# Altium project DM6010_R2M2E2.PrjPcb
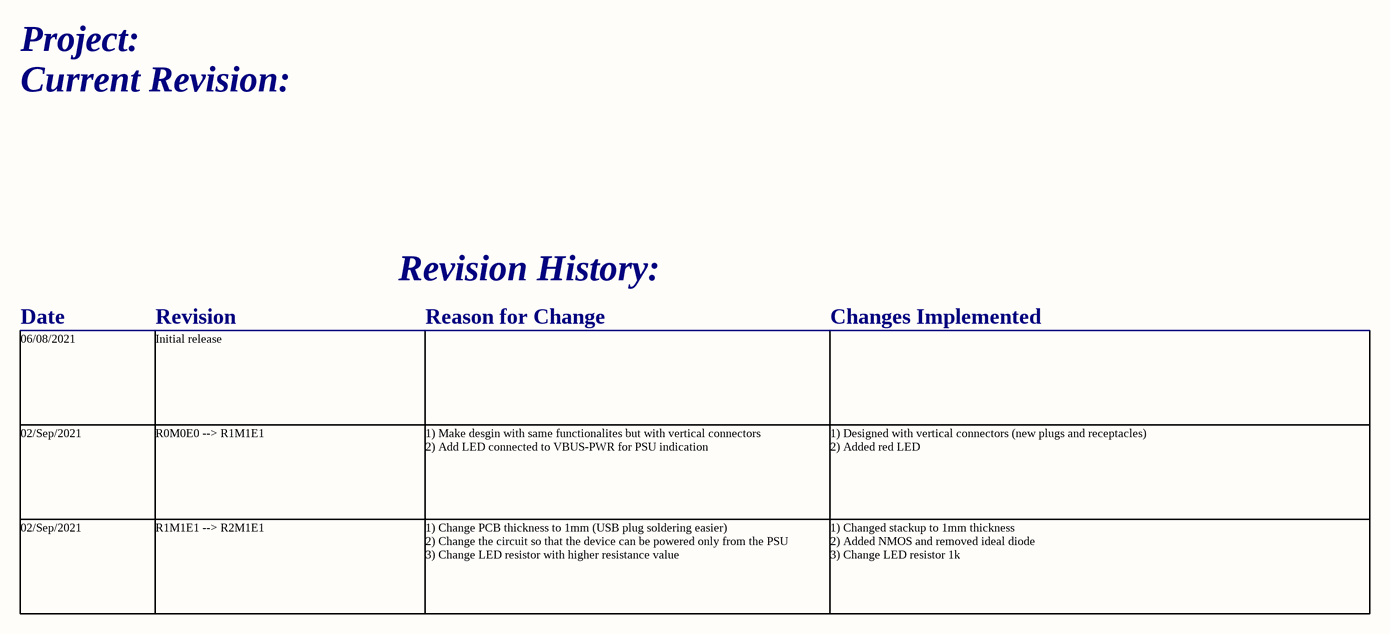
[diagram p0: Project_Information.SchDoc]
document_number: D0001093; drawn_by: David Malovrh; project_title: DM6010; revision: R2M2E2
2 sheets, 12 parts. Net scope: strictly hierarchical (ports join the sheet entries above them; power ports are local).
Board file: DM6010_R2M2E2.PcbDoc
Sheets:
  Project_Information.SchDoc
  DM6010.SchDoc

## Sheet Project_Information.SchDoc: =project_title
size Tabloid; CompanyName: Luxonis Holding; DrawnBy: David Malovrh; Organization: Luxonis Holding; Address1: 1925 Harmony Park Drive; Address2: Westminster, CO; Address3: 80234; Address4: United States; DocumentNumber: D0001093; Revision: R2M2E2; SheetNumber: 1; SheetTotal: 9

### Notes on the sheet
- Project:
- Current Revision:
- Revision History:
- Date
- Revision
- Reason for Change
- Changes Implemented
- 06/08/2021
- Initial release
- 02/Sep/2021
- R0M0E0 --> R1M1E1
- 1) Make desgin with same functionalites but with vertical connectors
  2) Add LED connected to VBUS-PWR for PSU indication
- 1) Designed with vertical connectors (new plugs and receptacles)
  2) Added red LED
- R1M1E1 --> R2M1E1
- 1) Change PCB thickness to 1mm (USB plug soldering easier)
  2) Change the circuit so that the device can be powered only from the PSU
  3) Change LED resistor with higher resistance value
- 1) Changed stackup to 1mm thickness
  2) Added NMOS and removed ideal diode
  3) Change LED resistor 1k
- Title
- Size:
- Date:
- Tabloid
- Number:
- Time:
- Revision:
- Sheet
- of
- Drawn by:

## Sheet DM6010.SchDoc: =project_title
size Tabloid; CompanyName: Luxonis Holding; DrawnBy: David Malovrh; Organization: Luxonis Holding; Address1: 1925 Harmony Park Drive; Address2: Westminster, CO; Address3: 80234; Address4: United States; DocumentNumber: D0001093; Revision: R2M2E2; SheetNumber: 9; SheetTotal: 9
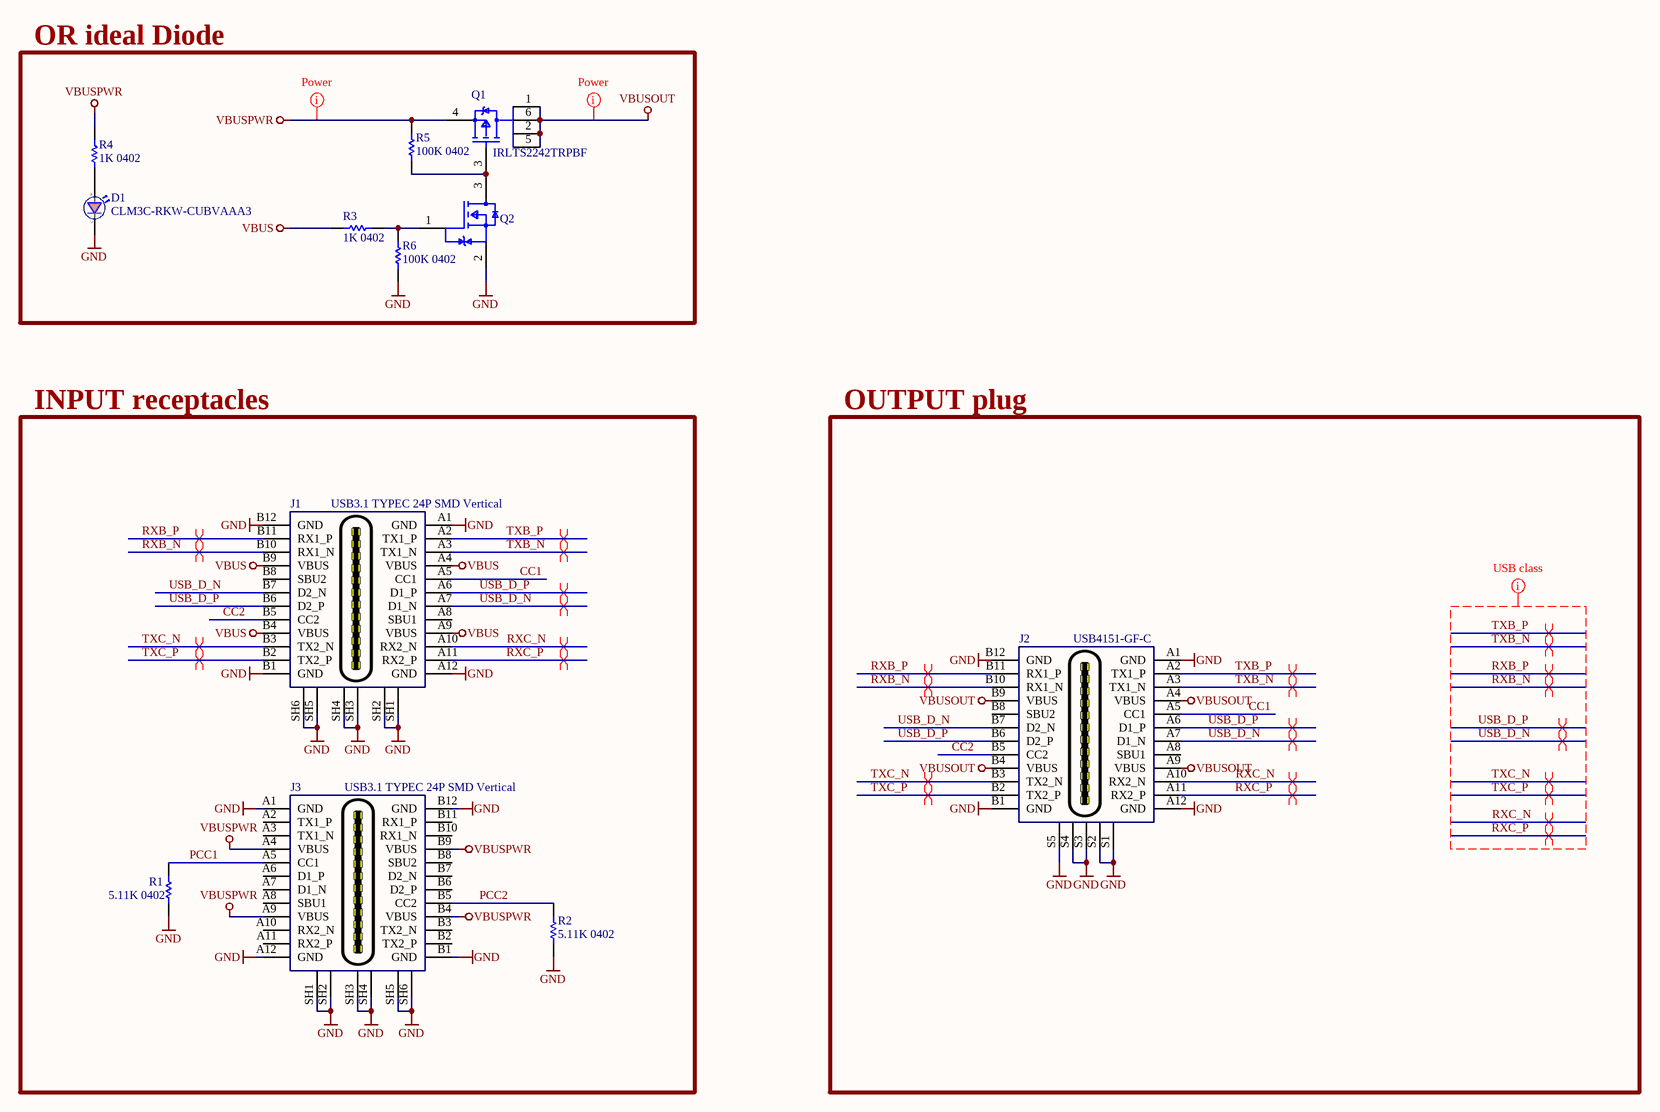
[diagram p1: DM6010.SchDoc]

### Parts
D1  CLM3C-RKW-CUBVAAA3  [CLM3C-RKW-CUBVAAA3]
J1  USB3.1 TYPEC 24P SMD Vertical  [CX80B1-24P]
J2  USB4151-GF-C  [GCT_USB4151-GF-C_REVA]
J3  USB3.1 TYPEC 24P SMD Vertical  [CX80B1-24P]
Q1  IRLTS2242TRPBF  [TSOP-6-MFG]
Q2  RE1C002UNTCL  [RE1C002UNTCL]  (value not drawn)
R1  5.11K 0402  [RESC0402(1005)_L]
R2  5.11K 0402  [RESC0402(1005)_L]
R3  1K 0402  [RESC0402(1005)_L]
R4  1K 0402  [RESC0402(1005)_L]
R5  100K 0402  [RESC0402(1005)_L]
R6  100K 0402  [RESC0402(1005)_L]

### Blocks framed on the sheet
OR ideal Diode: D1 Q1 Q2 R3-R6
INPUT receptacles: J1 J3 R1 R2
OUTPUT plug: J2

### Nets
GND: D1.2(C) J1.A1(GND) J1.A12(GND) J1.B1(GND) J1.B12(GND) J1.SH1(SH) J1.SH2(SH) J1.SH3(SH) J1.SH4(SH) J1.SH5(SH) J1.SH6(SH) J2.A1(GND) J2.A12(GND) J2.B1(GND) J2.B12(GND) J2.S1(SH) J2.S2(SH) J2.S3(SH) J2.S4(SH) J2.S5(SH) J3.A1(GND) J3.A12(GND) J3.B1(GND) J3.B12(GND) J3.SH1(SH) J3.SH2(SH) J3.SH3(SH) J3.SH4(SH) J3.SH5(SH) J3.SH6(SH) Q2.2(Source) R1.1 R2.1 R6.1
VBUS: J1.A4(VBUS) J1.A9(VBUS) J1.B4(VBUS) J1.B9(VBUS) R3.1
VBUSOUT: J2.A4(VBUS) J2.A9(VBUS) J2.B4(VBUS) J2.B9(VBUS) Q1.1(D) Q1.2(D) Q1.5(D) Q1.6(D)
VBUSPWR: J3.A4(VBUS) J3.A9(VBUS) J3.B4(VBUS) J3.B9(VBUS) Q1.4(S) R4.2 R5.2
CC1: J1.A5(CC1) J2.A5(CC1)
CC2: J1.B5(CC2) J2.B5(CC2)
PCC1: J3.A5(CC1) R1.2
PCC2: J3.B5(CC2) R2.2
RXB_N: J1.B10(RX1_N) J2.B10(RX1_N)
RXB_P: J1.B11(RX1_P) J2.B11(RX1_P)
RXC_N: J1.A10(RX2_N) J2.A10(RX2_N)
RXC_P: J1.A11(RX2_P) J2.A11(RX2_P)
TXB_N: J1.A3(TX1_N) J2.A3(TX1_N)
TXB_P: J1.A2(TX1_P) J2.A2(TX1_P)
TXC_N: J1.B3(TX2_N) J2.B3(TX2_N)
TXC_P: J1.B2(TX2_P) J2.B2(TX2_P)
USB_D_N: J1.A7(D1_N) J1.B7(D2_N) J2.A7(D1_N) J2.B7(D2_N)
USB_D_P: J1.A6(D1_P) J1.B6(D2_P) J2.A6(D1_P) J2.B6(D2_P)
NetD1_1: D1.1(A) R4.1
NetQ1_3: Q1.3(G) Q2.3(Drain) R5.1
NetQ2_1: Q2.1(Gate) R3.2 R6.2

Not connected (* = marked no-connect by the designer): J1 A8(SBU1) B8(SBU2); J2 A8(SBU1) B8(SBU2); J3 A2(TX1_P) A3(TX1_N) A6(D1_P) A7(D1_N) A8(SBU1) A10(RX2_N) A11(RX2_P) B2(TX2_P) B3(TX2_N) B6(D2_P) B7(D2_N) B8(SBU2) B10(RX1_N) B11(RX1_P)

### Layout directives
differential pair; differential pair class USB3: RXB_N, RXB_P, RXC_N, RXC_P, TXB_N, TXB_P, TXC_N, TXC_P, USB_D_N, USB_D_P
rule Matched Net Lengths [Delay Tolerance = 0,5ps]; net class USB: RXB_N, RXB_P, RXC_N, RXC_P, TXB_N, TXB_P, TXC_N, TXC_P, USB_D_N, USB_D_P
net class Power_trace: VBUSOUT, VBUSPWR

### Notes on the sheet
- Title
- Size:
- Date:
- Tabloid
- Number:
- Time:
- Revision:
- Sheet
- of
- Drawn by:

### Library data of the parts
D1 = CLM3C-RKW-CUBVAAA3: Single Color LED, Red; Manufacturer 1: Cree; Shape: Rectangular; Additional Feature: HIGH RELIABILITY; Forward Current-Max: 50mA; Luminous Intensity-Nom: 730mcd; Number of Functions: 1; Viewing Angle: 120°; Overall Height: 1.3mm; Supplier 1: Arrow Electronics; Manufacturer Part Number 1: CLM3C-RKW-CUBVAAA3; RoHS: Yes; Category: LEDs; Stock 1: 46; Pricing 1: 1=0,16910, 10=0,15700, 25=0,15600, 3000=0,11060, 6000=0,10380, 9000=0,10200 (USD); Mount: Surface Mount; Number of Pins: 2; Color: Red; Min Operating Temperature: -40°C; Max Operating Temperature: 100°C; Optoelectronic Device Type: SINGLE COLOR LED; Packaging: Tape and Reel; REACH SVHC: No SVHC; RoHS Compliant: Yes; ComponentLink1URL: https://datasheet.ciiva.com:443/pdfs/VipMasterIC/IC/CREE/CREE-S-A0009778054/CREE-S-A0009831191-1.pdf?src-supplier=IHS+Markit; ComponentLink1Description: https://datasheet.ciiva.com:443/pdfs/VipMasterIC/IC/CREE/CREE-S-A0009778054/CREE-S-A0009831191-1.pdf?src-supplier=IHS+Markit; ComponentLink2URL: https://datasheet.ciiva.com/15210/getdatasheetpartid-563038-15210357.pdf?src-supplier=Verical; ComponentLink2Description: https://datasheet.ciiva.com/15210/getdatasheetpartid-563038-15210357.pdf?src-supplier=Verical; ComponentLink3URL: https://datasheet.ciiva.com/2116/clm3crkwakw1156-2116358.pdf?src-supplier=Digi-Key; ComponentLink3Description: https://datasheet.ciiva.com/2116/clm3crkwakw1156-2116358.pdf?src-supplier=Digi-Key; Supplier Part Number 1: CLM3C-RKW-CUBVAAA3
J1 J3 = CX80B1-24P: CONN RCPT USB3.1 TYPEC 24POS SMD Vertical; Manufacturer 1: Hirose Electric Co Ltd; Connector Type: USB; Number of Contacts: 24; Gender: Receptacle; Number of Ports: 1; Current Rating: 1.25A; Mating Cycles: 10000; Pitch: 0.5mm; Shielding: Shielded; Supplier 1: Digi-Key; Case/Package: 0101; Number of Pins: 24; Contact Material: Copper Alloy; Contact Plating: Gold; Number of Terminals: 24; Housing Material: Thermoplastic; Insulation Color: Black; Min Operating Temperature: -30°C; Max Operating Temperature: 80°C; Packaging: Tape and Reel; Orientation: Vertical; Termination: Solder; USB Standard: USB 3.1; Features: Shielded; Length: 8.94mm; REACH SVHC: Unknown; Flammability Rating: UL94 V-0; Supplier Part Number 1: 26-CX80B1-24PCT-ND; Mount: Surface Mount,Through Hole,Vertical; RoHS: Yes; Pricing 1: 1=2.15000, 10=1.94900, 25=1.82960, 50=1.75000, 100=1.67050, 250=1.51140, 500=1.39208 (USD); Stock 1: 939; Manufacturer Part Number 1: CX80B1-24P; ComponentLink1Description: Product page; ComponentLink1URL: https://www.jae.com/en/connectors/series/detail/product/id=66513; ComponentLink2Description: Digikey; ComponentLink2URL: https://www.digikey.com/en/products/detail/jae-electronics/DX07S024WJ3R400/6594044
J2 = USB4151-GF-C: USB Connector, 24 Contact(s), Male, Straight, Surface Mount Terminal, Locking, Plug; Manufacturer 1: Global Connector Technology; Supplier 1: Newark; Manufacturer Part Number 1: USB4151-GF-C; RoHS: Yes; Stock 1: 1006; Pricing 1: 1=1,89000, 10=1,74000, 25=1,62000, 50=1,50000, 100=1,35000, 250=1,20000 (USD); Supplier Part Number 1: 86AH2023
Q1 = IRLTS2242TRPBF: MOSFET P-CH 20V 6.9A 6TSOP; Manufacturer 1: Infineon; Rise Time: 18ns; Threshold Voltage: -400mV; Max Power Dissipation: 2W; Gate to Source Voltage (Vgs): 12V; Input Capacitance: 905pF; Max Dual Supply Voltage: -20V; Rds On Max: 32mR; Contact Plating: Tin; Number of Pins: 6; Mount: Surface Mount; Halogen Free: Halogen Free; Packaging: Tape and Reel; Continuous Drain Current (ID): 6.9A; Case/Package: TSOP; REACH SVHC: No SVHC; RoHS Compliant: Yes; Min Operating Temperature: -55°C; Lead Free: Lead Free; Max Operating Temperature: 150°C; Drain to Source Voltage (Vdss): -20V; Manufacturer Part Number 1: IRLTS2242TRPBF
Q2 = RE1C002UNTCL: VISHAY - SI1062X-T1-GE3 - MOSFET Transistor, N Channel, 530 mA, 20 V, 0.35 ohm, 4.5 V, 1 V; Manufacturer 1: Rohm; Drain to Source Voltage (Vdss): 20V; Continuous Drain Current (ID): 200mA; Rds On Max: 1.2R; Input Capacitance: 25pF; Max Power Dissipation: 150mW; Rise Time: 14ns; Drain to Source Resistance: 350mR; Gate to Source Voltage (Vgs): 8V; Fall Time: 11ns; Turn-Off Delay Time: 16ns; Number of Elements: 1; Power Dissipation: 220mW; Turn-On Delay Time: 2ns; Threshold Voltage: 1V; Element Configuration: Single; On-State Resistance: 420mR; Polarity: N-CHANNEL; RoHS: Yes; Mount: Surface Mount; Case/Package: SOT-89; Packaging: Tape and Reel; Lead Free: Lead Free; ComponentLink1URL: http://www.mouser.com/ds/2/348/re1c002untcl-e-1018231.pdf?src-supplier=Mouser; ComponentLink1Description: http://www.mouser.com/ds/2/348/re1c002untcl-e-1018231.pdf?src-supplier=Mouser; ComponentLink2URL: http://rohmfs.rohm.com/en/techdata_basic/transistor/taping/EMT3_TL_taping.pdf?src-supplier=Digi-Key; ComponentLink2Description: http://rohmfs.rohm.com/en/techdata_basic/transistor/taping/EMT3_TL_taping.pdf?src-supplier=Digi-Key; ComponentLink3URL: http://rohmfs.rohm.com/en/products/databook/datasheet/discrete/transistor/mosfet/re1c002un.pdf?src-supplier=Avnet; ComponentLink3Description: http://rohmfs.rohm.com/en/products/databook/datasheet/discrete/transistor/mosfet/re1c002un.pdf?src-supplier=Avnet; ComponentLink4URL: https://www.rohm.com/datasheet/RE1C002UN/re1c002untcl-e?src-supplier=Digi-Key; ComponentLink4Description: https://www.rohm.com/datasheet/RE1C002UN/re1c002untcl-e?src-supplier=Digi-Key; ComponentLink5URL: http://www.farnell.com/datasheets/2704376.pdf?src-supplier=Newark; ComponentLink5Description: http://www.farnell.com/datasheets/2704376.pdf?src-supplier=Newark; ComponentLink6URL: http://www.farnell.com/datasheets/2704376.pdf?src-supplier=Farnell; ComponentLink6Description: http://www.farnell.com/datasheets/2704376.pdf?src-supplier=Farnell; ComponentLink7URL: http://www.farnell.com/datasheets/2704376.pdf?src-supplier=Element14; ComponentLink7Description: http://www.farnell.com/datasheets/2704376.pdf?src-supplier=Element14; Supplier 1: Digi-Key; Manufacturer Part Number 1: RE1C002UNTCL; Stock 1: 868886; Pricing 1: 1=0.20000, 10=0.18200, 100=0.09930, 500=0.06112, 1000=0.04167 (USD); Supplier Part Number 1: RE1C002UNTCLCT-ND; Supplier 2: Digi-Key; Manufacturer 2: Vishay Siliconix; Manufacturer Part Number 2: SI1062X-T1-GE3; Category: MOSFETs; Stock 2: 28076; Pricing 2: 1=0,47000, 10=0,33100, 25=0,30800, 100=0,16720, 500=0,13640, 1000=0,10120 (USD); Number of Pins: 3; Weight: 0.001058oz; Min Operating Temperature: -55°C; Max Operating Temperature: 150°C; Package Quantity: 3000; Drain to Source Breakdown Voltage: 20V; Number of Channels: 1; Series: TrenchFET®; Drain-source On Resistance-Max: 420mR; REACH SVHC: No SVHC; RoHS Compliant: Yes; ComponentLink8URL: https://datasheet.ciiva.com/6376/si1062x-6376310.pdf?src-supplier=Digi-Key; ComponentLink8Description: https://datasheet.ciiva.com/6376/si1062x-6376310.pdf?src-supplier=Digi-Key; ComponentLink9URL: https://datasheet.ciiva.com/24011/si1062x-256537-24011195.pdf?src-supplier=Mouser; ComponentLink9Description: https://datasheet.ciiva.com/24011/si1062x-256537-24011195.pdf?src-supplier=Mouser; ComponentLink10URL: https://datasheet.ciiva.com/6376/si1062x-6376251.pdf?src-supplier=Digi-Key; ComponentLink10Description: https://datasheet.ciiva.com/6376/si1062x-6376251.pdf?src-supplier=Digi-Key; Supplier 3: Digi-Key; Supplier Part Number 2: SI1062X-T1-GE3CT-ND; Supplier Part Number 3: SI1062X-T1-GE3TR-ND
R1 R2 = RC0402FR-075K11L: RES SMD 5.11K OHM 1% 1/16W 0402 5.11 kOhms ±1% 0.063W, 1/16W Chip Resistor 0402 (1005 Metric) Moisture Resistant Thick Film; Manufacturer 1: Yageo; Resistance: 5.11kR; Power Rating: 62.5mW; Voltage Rating: 50V; Temperature Coefficient: 100ppm/°C; Max Power Dissipation: 63mW; ComponentLink1URL: https://datasheet.ciiva.com/2518/pyu-r-int-thick-7-2518982.pdf?src-supplier=Digi-Key; ComponentLink1Description: https://datasheet.ciiva.com/2518/pyu-r-int-thick-7-2518982.pdf?src-supplier=Digi-Key; ComponentLink2URL: https://datasheet.ciiva.com/2518/pyu-r-int-thick-7-2518983.pdf?src-supplier=Digi-Key; ComponentLink2Description: https://datasheet.ciiva.com/2518/pyu-r-int-thick-7-2518983.pdf?src-supplier=Digi-Key; ComponentLink3URL: https://datasheet.ciiva.com/5684/1018594-5684622.pdf?src-supplier=Farnell; ComponentLink3Description: https://datasheet.ciiva.com/5684/1018594-5684622.pdf?src-supplier=Farnell; ComponentLink4URL: https://datasheet.ciiva.com/16743/pyu-rc0402-51-rohs-l-6-r-16743871.pdf?src-supplier=Future+Electronics; ComponentLink4Description: https://datasheet.ciiva.com/16743/pyu-rc0402-51-rohs-l-6-r-16743871.pdf?src-supplier=Future+Electronics; Supplier 1: Digi-Key; Manufacturer Part Number 1: RC0402FR-075K11L; Stock 1: 1263456; Pricing 1: 1=0.10000, 10=0.01600, 100=0.00670, 1000=0.00301, 2500=0.00261, 5000=0.00215 (USD); RoHS: Yes; Case/Package: 0402; Case Code (Imperial): 0402; Case Code (Metric): 1005; Min Operating Temperature: -55°C; Max Operating Temperature: 155°C; Tolerance: 1%; Packaging: Tape and Reel; Package Quantity: 1; Termination: SMD/SMT; Composition: Thick Film; Number of Terminations: 2; Military Standard: Not; Voltage Rating (DC): 50V; Working Voltage: 50V; Features: Moisture Resistant; Length: 1mm; Height: 0.016inch; Width: 0.02inch; Depth: 0.5mm; Lead Free: Lead Free; Supplier Part Number 1: 311-5.11KLRCT-ND
R3 R4 = RC0402FR-071KL: RES SMD 1K OHM 1% 1/16W 0402 1 kOhms ±1% 0.063W, 1/16W Chip Resistor 0402 (1005 Metric) Moisture Resistant Thick Film; Manufacturer 1: Yageo; Temperature Coefficient: 100ppm/°C; Power Rating: 62.5mW; Voltage Rating (DC): 50V; Resistance: 1kR; RoHS: Yes; Number of Pins: 2; Case Code (Imperial): 0402; Case Code (Metric): 1005; Min Operating Temperature: -55°C; Max Operating Temperature: 155°C; Packaging: Tape and Reel; Composition: Thick Film; Voltage Rating: 50V; Military Standard: Not; Termination: SMD/SMT; Length: 1mm; Height: 0.32mm; Width: 0.5mm; Depth: 0.5mm; Lead Free: Lead Free; REACH SVHC: Unknown; ComponentLink1URL: https://datasheet.ciiva.com/11819/0900766b80c66297-11819477.pdf?src-supplier=RSComponents; ComponentLink1Description: https://datasheet.ciiva.com/11819/0900766b80c66297-11819477.pdf?src-supplier=RSComponents; ComponentLink2URL: https://datasheet.ciiva.com/12666/pyu-rc0402-51-rohs-l-6-r-12666741.pdf?src-supplier=Mouser; ComponentLink2Description: https://datasheet.ciiva.com/12666/pyu-rc0402-51-rohs-l-6-r-12666741.pdf?src-supplier=Mouser; ComponentLink3URL: https://datasheet.ciiva.com/17063/pyu-rc0402-51-rohs-l-6-r-17063193.pdf?src-supplier=Future+Electronics; ComponentLink3Description: https://datasheet.ciiva.com/17063/pyu-rc0402-51-rohs-l-6-r-17063193.pdf?src-supplier=Future+Electronics; ComponentLink4URL: https://datasheet.ciiva.com/22747/1018594-22747513.pdf?src-supplier=Element14; ComponentLink4Description: https://datasheet.ciiva.com/22747/1018594-22747513.pdf?src-supplier=Element14; ComponentLink5URL: https://datasheet.ciiva.com/7849/1018594-7849869.pdf?src-supplier=Element14; ComponentLink5Description: https://datasheet.ciiva.com/7849/1018594-7849869.pdf?src-supplier=Element14; ComponentLink6URL: https://datasheet.ciiva.com/7983/1018594-7983502.pdf?src-supplier=Element14; ComponentLink6Description: https://datasheet.ciiva.com/7983/1018594-7983502.pdf?src-supplier=Element14; ComponentLink7URL: https://datasheet.ciiva.com/7849/1018594-7849871.pdf?src-supplier=Element14; ComponentLink7Description: https://datasheet.ciiva.com/7849/1018594-7849871.pdf?src-supplier=Element14; Supplier 1: Digi-Key; Manufacturer Part Number 1: RC0402FR-071KL; Stock 1: 60695854; Pricing 1: 1=0.10000, 10=0.01600, 100=0.00670, 1000=0.00301, 2500=0.00261, 5000=0.00215 (USD); Case/Package: 0402; Tolerance: 1%; Supplier Part Number 1: 311-1.00KLRCT-ND
R5 R6 = RC0402FR-07100KL: RES SMD 100K OHM 1% 1/16W 0402; Manufacturer 1: Yageo; Power Rating: 63mW; Resistance: 100kR; Temperature Coefficient: 100ppm/°C; Voltage Rating: 50V; Supplier 1: Digi-Key; Manufacturer Part Number 1: RC0402FR-07100KL; Stock 1: 50867324; Pricing 1: 1=0.10000, 10=0.01500, 100=0.00600, 1000=0.00270, 2500=0.00235, 5000=0.00194 (USD); RoHS: Yes; Case/Package: 0402; Case Code (Metric): 1005; Case Code (Imperial): 0402; Min Operating Temperature: -55°C; Max Operating Temperature: 155°C; Tolerance: 1%; Packaging: Tape and Reel; Composition: Thick Film; Termination: SMD/SMT; Military Standard: Not; Package Quantity: 1; Number of Terminations: 2; Max Power Dissipation: 63mW; Features: Moisture Resistant; Working Voltage: 50V; Length: 0.039inch; Height: 0.016inch; Width: 0.02inch; Depth: 0.5mm; Lead Free: Lead Free; REACH SVHC: No SVHC; ComponentLink1URL: https://datasheet.ciiva.com/11819/0900766b80c66297-11819452.pdf?src-supplier=RSComponents; ComponentLink1Description: https://datasheet.ciiva.com/11819/0900766b80c66297-11819452.pdf?src-supplier=RSComponents; ComponentLink2URL: https://datasheet.ciiva.com/2453/pyu-r-int-thick-7-2453361.pdf?src-supplier=Digi-Key; ComponentLink2Description: https://datasheet.ciiva.com/2453/pyu-r-int-thick-7-2453361.pdf?src-supplier=Digi-Key; ComponentLink3URL: https://datasheet.ciiva.com/2453/pyu-r-int-thick-7-2453362.pdf?src-supplier=Digi-Key; ComponentLink3Description: https://datasheet.ciiva.com/2453/pyu-r-int-thick-7-2453362.pdf?src-supplier=Digi-Key; ComponentLink4URL: https://datasheet.ciiva.com/2453/pyu-r-int-thick-7-2453363.pdf?src-supplier=Digi-Key; ComponentLink4Description: https://datasheet.ciiva.com/2453/pyu-r-int-thick-7-2453363.pdf?src-supplier=Digi-Key; ComponentLink5URL: https://datasheet.ciiva.com/22747/1018594-22747509.pdf?src-supplier=Element14; ComponentLink5Description: https://datasheet.ciiva.com/22747/1018594-22747509.pdf?src-supplier=Element14; ComponentLink6URL: https://datasheet.ciiva.com/15189/getdatasheetpartid-323696-15189334.pdf?src-supplier=Verical; ComponentLink6Description: https://datasheet.ciiva.com/15189/getdatasheetpartid-323696-15189334.pdf?src-supplier=Verical; ComponentLink7URL: https://datasheet.ciiva.com/12667/pyu-rc0402-51-rohs-l-6-r-12667930.pdf?src-supplier=Mouser; ComponentLink7Description: https://datasheet.ciiva.com/12667/pyu-rc0402-51-rohs-l-6-r-12667930.pdf?src-supplier=Mouser; Supplier 2: Newark; Supplier 3: Mouser; Supplier Part Number 1: 311-100KLRCT-ND; Supplier Part Number 2: 67R9887; Supplier Part Number 3: 603-RC0402FR-07100KL

## Assembly variants
Production: not fitted B1 C23 C33 C74 C75 C91 C92 C99 C100 C101 C102 C103 C104 C105 C109 D3 D5 FB10 FB14 J1 J3 M1 M5 R1 R2 R3 R28 R30 R44 R58 R65 R69 R70 R71 R75 R76 U3 U11 Y1
Production_sample: not fitted C23 C33 C74 C75 C91 C92 FB10 FB14 J1 R1 R28 R30 R44 R58 R75 R76 U3